# EAGLE design BM_ pre (EAGLE 8.1.0)

## Sheet 1 of 3: Microcontroller
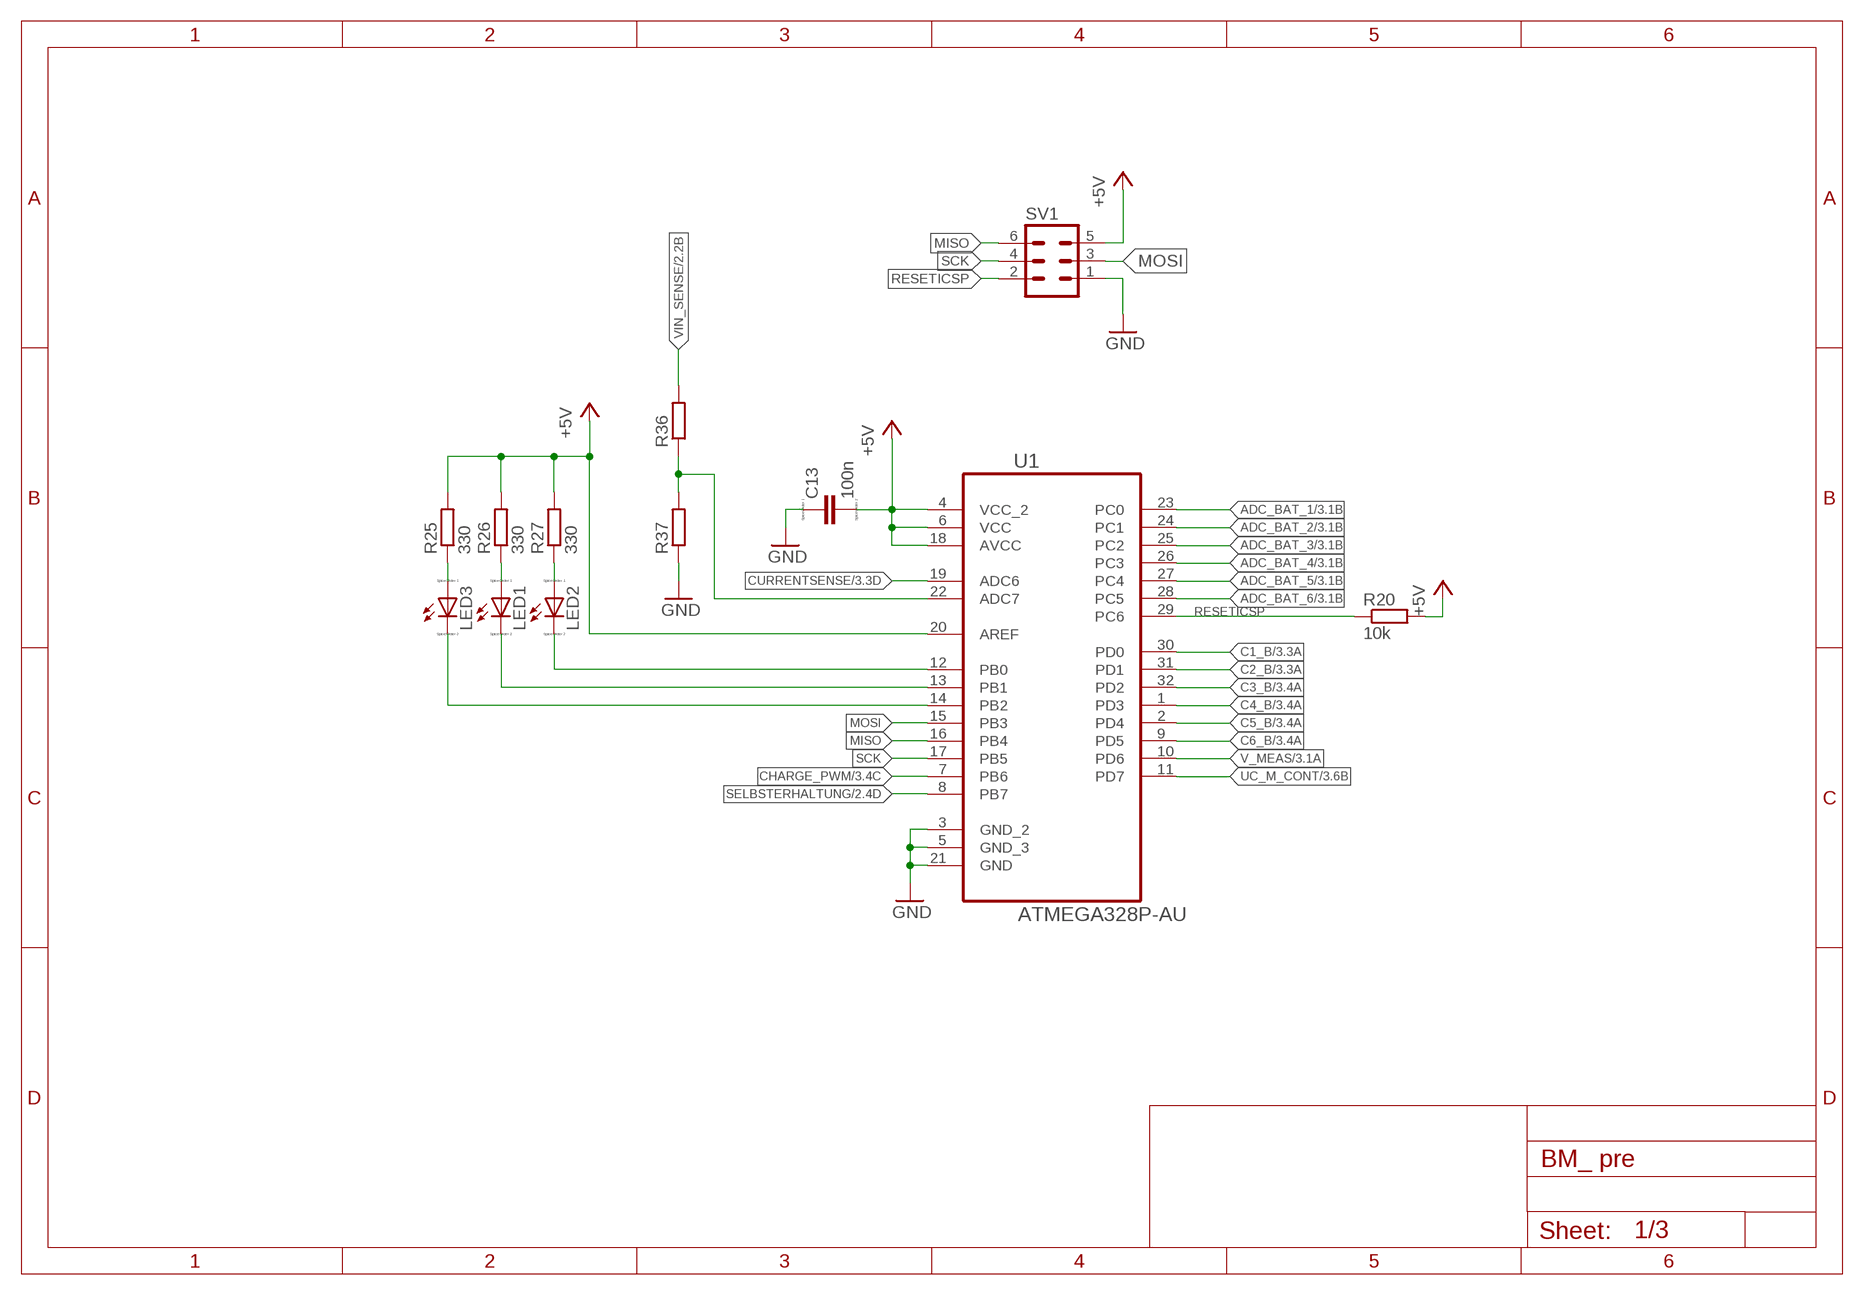
[diagram p0: schematic, sheet 1]

### Parts
C13  100n  CC0603  [C0603]
LED1  LED_E  [LED_1206]
LED2  LED_E  [LED_1206]
LED3  LED_E  [LED_1206]
R20  10k  R-EU_R0603  [R0603]
R25  330  R-EU_R0603  [R0603]
R26  330  R-EU_R0603  [R0603]
R27  330  R-EU_R0603  [R0603]
R36  R-EU_R0603  [R0603]
R37  R-EU_R0603  [R0603]
SV1  MA03-2  [MA03-2]
U1  ATMEGA328P-AU  [QFP80P900X900X120-32N]

### Nets
+5V: C13.2 R20.2 R25.2 R26.2 R27.2 SV1.5 U1.4(VCC_2) U1.6(VCC) U1.18(AVCC) U1.20(AREF) ; also sheet 2,3
ADC_BAT_1: U1.23(PC0) ; also sheet 3
ADC_BAT_2: U1.24(PC1) ; also sheet 3
ADC_BAT_3: U1.25(PC2) ; also sheet 3
ADC_BAT_4: U1.26(PC3) ; also sheet 3
ADC_BAT_5: U1.27(PC4) ; also sheet 3
ADC_BAT_6: U1.28(PC5) ; also sheet 3
C1_B: U1.30(PD0) ; also sheet 3
C2_B: U1.31(PD1) ; also sheet 3
C3_B: U1.32(PD2) ; also sheet 3
C4_B: U1.1(PD3) ; also sheet 3
C5_B: U1.2(PD4) ; also sheet 3
C6_B: U1.9(PD5) ; also sheet 3
CHARGE_PWM: U1.7(PB6) ; also sheet 3
CURRENTSENSE: U1.19(ADC6) ; also sheet 3
GND: C13.1 R37.1 SV1.1 U1.3(GND_2) U1.5(GND_3) U1.21(GND) ; also sheet 2,3
MISO: SV1.6 U1.16(PB4)
MOSI: SV1.3 U1.15(PB3)
N$17: LED2.C U1.12(PB0)
N$18: LED1.C U1.13(PB1)
N$19: LED3.C U1.14(PB2)
N$23: LED2.A R27.1
N$24: LED1.A R26.1
N$25: LED3.A R25.1
N$27: R36.1 R37.2 U1.22(ADC7)
RESETICSP: R20.1 SV1.2 U1.29(PC6)
SCK: SV1.4 U1.17(PB5)
SELBSTERHALTUNG: U1.8(PB7) ; also sheet 2
UC_M_CONT: U1.11(PD7) ; also sheet 3
V_MEAS: U1.10(PD6) ; also sheet 3
VIN_SENSE: R36.2 ; also sheet 2

## Sheet 2 of 3: Power Management
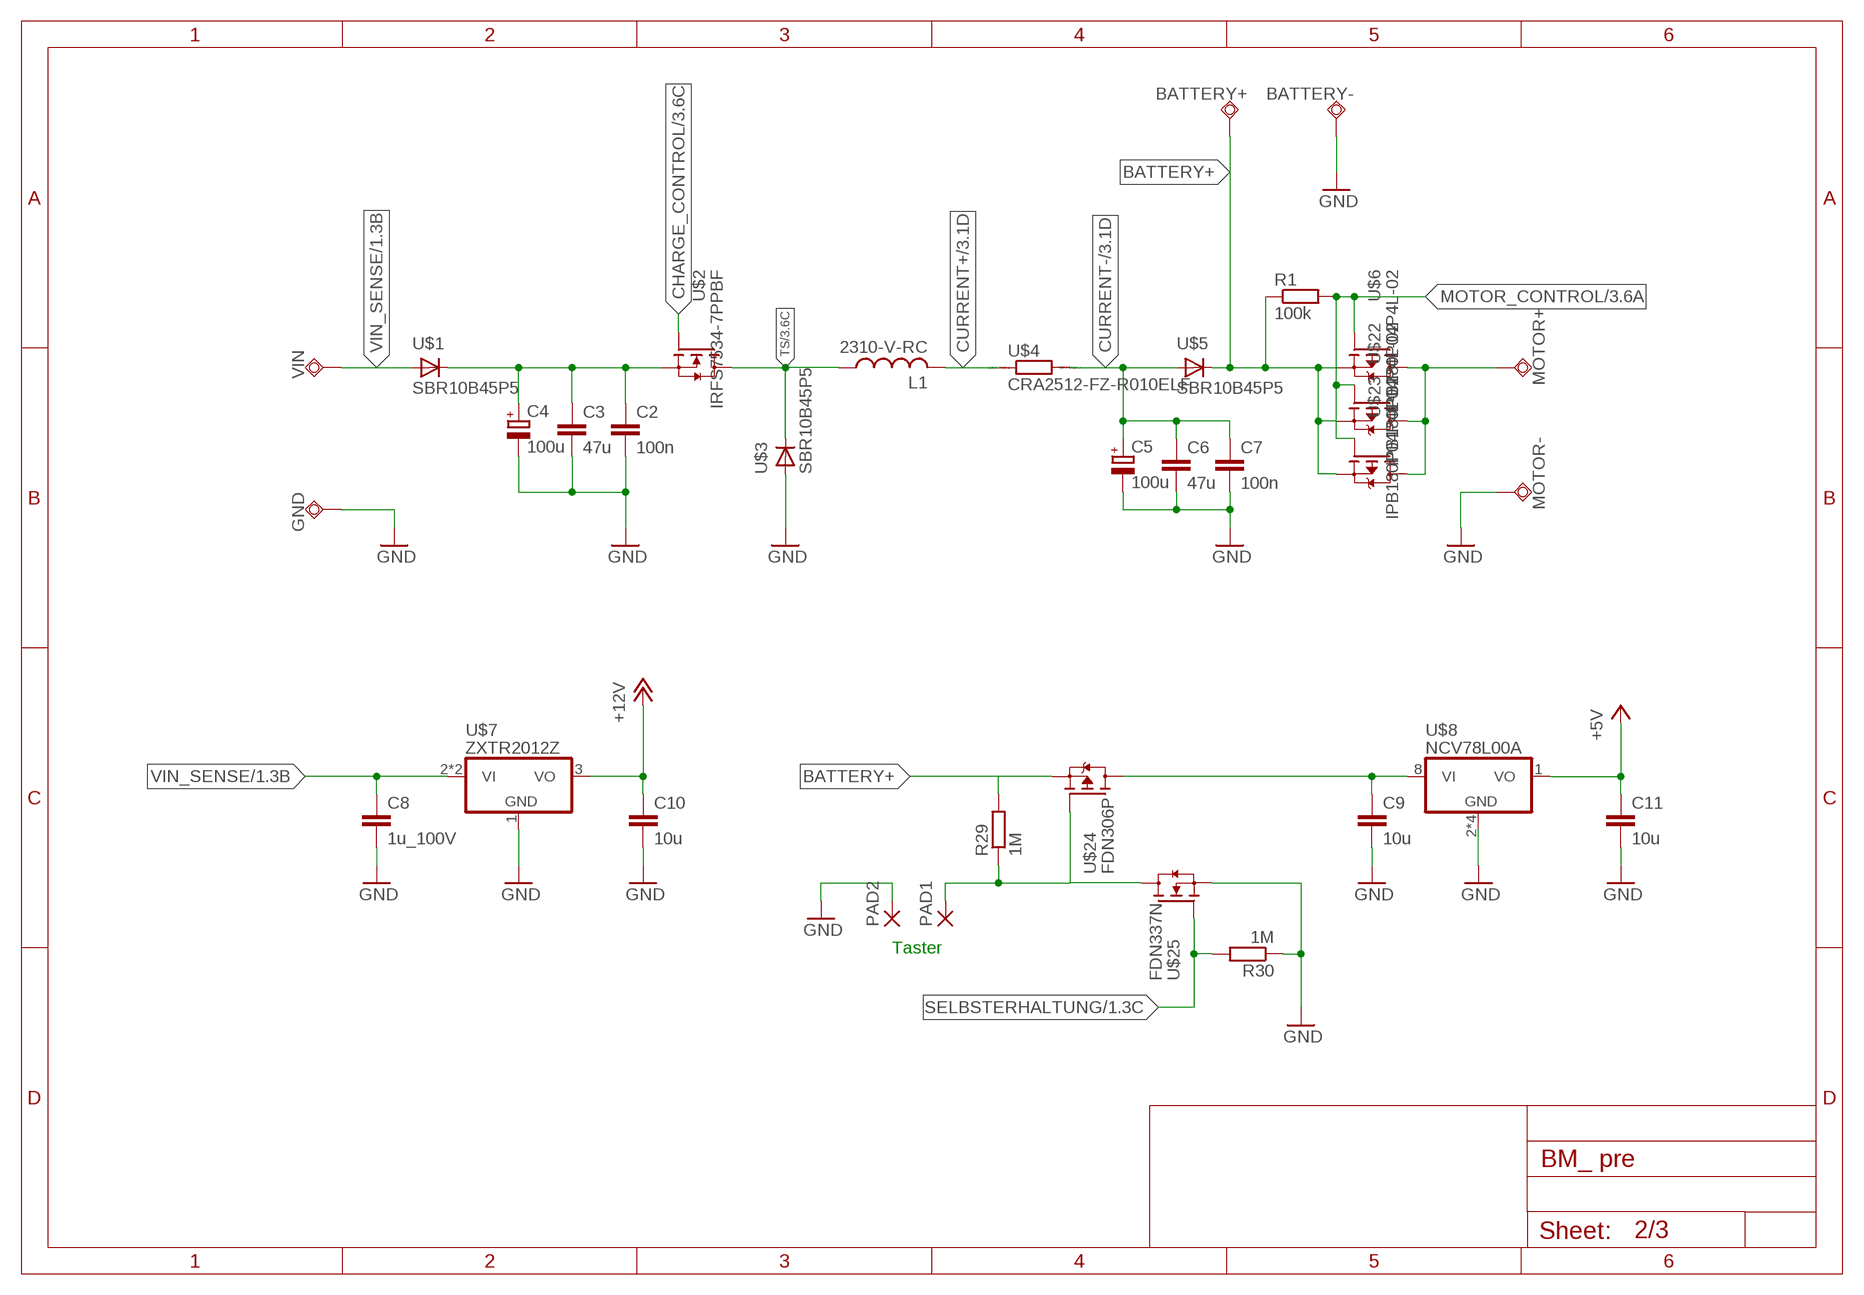
[diagram p1: schematic, sheet 2]

### Parts
BATTERY+  Battery+  PAD  [TESTPAD]
BATTERY-  Battery+  PAD  [TESTPAD]
C2  100n  C-EUC0603  [C0603]
C3  47u  C-EUC1812  [C1812]
C4  100u  CPOL-EUE3.5-10  [E3,5-10]
C5  100u  CPOL-EUE3.5-10  [E3,5-10]
C6  47u  C-EUC1812  [C1812]
C7  100n  C-EUC0603  [C0603]
C8  1u_100V  C-EUC1206  [C1206]
C9  10u  C-EUC0805  [C0805]
C10  10u  C-EUC0805  [C0805]
C11  10u  C-EUC0805  [C0805]
GND  Battery+  PAD  [TESTPAD]
L1  2310-V-RC  [IND_23XX-V_53_53]
MOTOR+  Battery+  PAD  [TESTPAD]
MOTOR-  PAD  [TESTPAD]
PAD1  SMD5  [SMD2,54-5,08]
PAD2  SMD5  [SMD2,54-5,08]
R1  100k  R-EU_R0603  [R0603]
R29  1M  R-EU_R0603  [R0603]
R30  1M  R-EU_R0603  [R0603]
U$1  SBR10B45P5  [POWERDI-5]
U$2  IRFS7534-7PPBF  [PG-TO263-7-3]
U$3  SBR10B45P5  [POWERDI-5]
U$4  CRA2512-FZ-R010ELF  [R2512]
U$5  SBR10B45P5  [POWERDI-5]
U$6  IPB180P04P4L-02  [PG-TO263-7-3]
U$7  ZXTR2012Z  [SOT89]
U$8  NCV78L00A  [SOIC8]
U$22  IPB180P04P4L-02  [PG-TO263-7-3]
U$23  IPB180P04P4L-02  [PG-TO263-7-3]
U$24  FDN306P  [SOT23]
U$25  FDN337N  [SOT23]
VIN  Battery+  PAD  [TESTPAD]

### Nets
+5V: C11.1 U$8.1(VO) ; also sheet 1,3
+12V: C10.1 U$7.3(VO) ; also sheet 3
BATTERY+: BATTERY+.P$1(TP) R1.1 R29.2 U$5.PAD(C) U$6.2(S) U$6.3(S) U$6.5(S) U$6.6(S) U$6.7(S) U$22.2(S) U$22.3(S) U$22.5(S) U$22.6(S) U$22.7(S) U$23.2(S) U$23.3(S) U$23.5(S) U$23.6(S) U$23.7(S) U$24.2(S)
CHARGE_CONTROL: U$2.1(G) ; also sheet 3
CURRENT+: L1.2 U$4.1 ; also sheet 3
CURRENT-: C5.+ C6.1 C7.1 U$4.2 U$5.L(A) U$5.R(A) ; also sheet 3
GND: BATTERY-.P$1(TP) C2.2 C3.2 C4.- C5.- C6.2 C7.2 C8.2 C9.2 C10.2 C11.2 GND.P$1(TP) MOTOR-.P$1(TP) PAD2.1(P) R30.1 U$3.L(A) U$3.R(A) U$7.1(GND) U$8.2(GND) U$8.3(GND) U$8.6(GND) U$8.7(GND) U$25.2(S) ; also sheet 1,3
MOTOR+: MOTOR+.P$1(TP) U$6.8(D) U$22.8(D) U$23.8(D)
MOTOR_CONTROL: R1.2 U$6.1(G) U$22.1(G) U$23.1(G) ; also sheet 3
N$1: C2.1 C3.1 C4.+ U$1.PAD(C) U$2.2(S) U$2.3(S) U$2.5(S) U$2.6(S) U$2.7(S)
N$20: PAD1.1(P) R29.1 U$24.1(G) U$25.3(D)
SELBSTERHALTUNG: R30.2 U$25.1(G) ; also sheet 1
TEST: C9.1 U$8.8(VI) U$24.3(D)
TS: L1.1 U$2.8(D) U$3.PAD(C) ; also sheet 3
VIN_SENSE: C8.1 U$1.L(A) U$1.R(A) U$7.2(VI) U$7.2@1(VI) VIN.P$1(TP) ; also sheet 1

### Notes on the sheet
- Taster

## Sheet 3 of 3: Battery Balancing and charging Addition
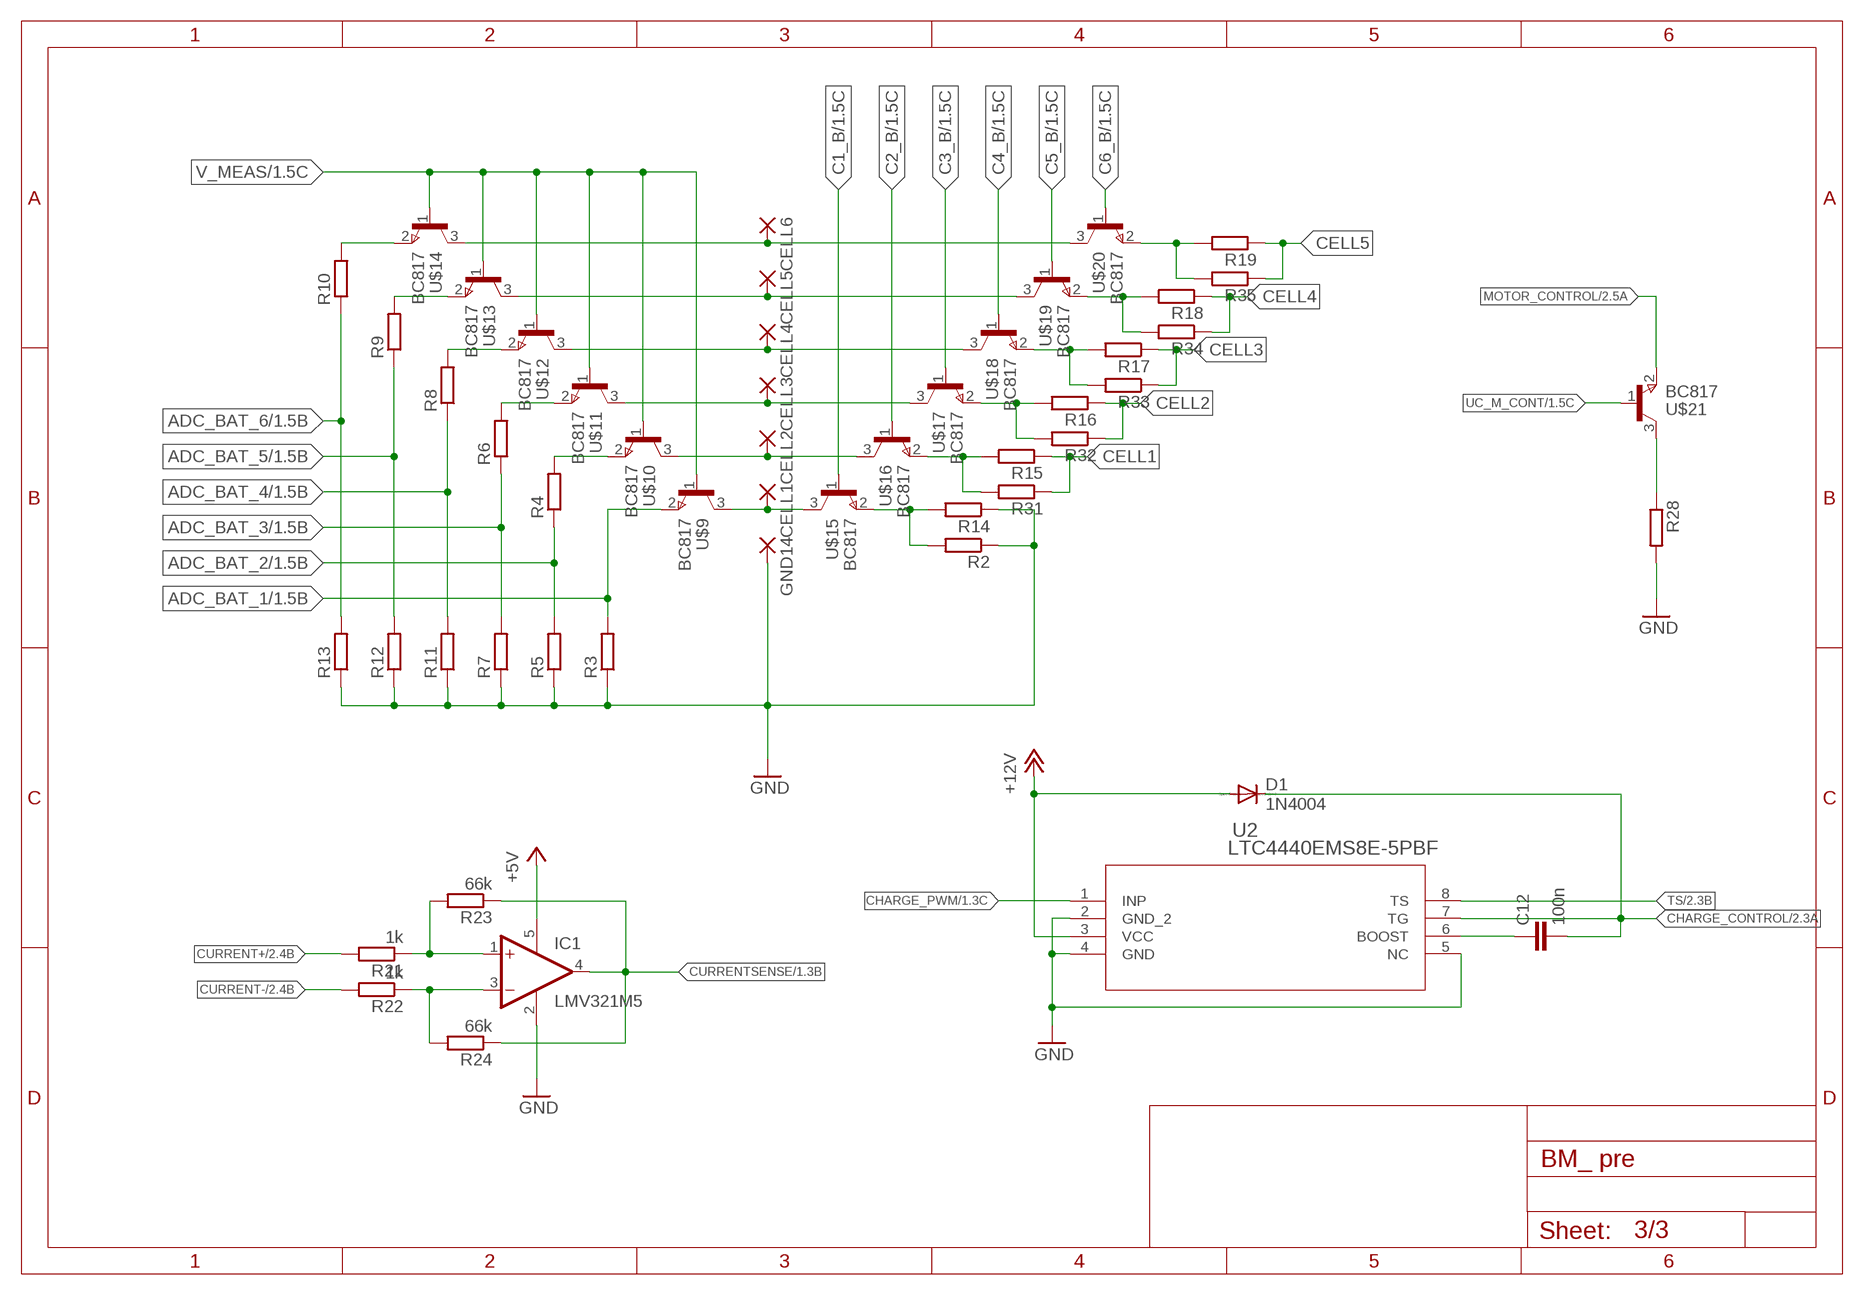
[diagram p2: schematic, sheet 3]

### Parts
C12  100n  C-EUC0603  [C0603]
CELL1  SMD5  [SMD2,54-5,08]
CELL2  SMD5  [SMD2,54-5,08]
CELL3  SMD5  [SMD2,54-5,08]
CELL4  SMD5  [SMD2,54-5,08]
CELL5  SMD5  [SMD2,54-5,08]
CELL6  SMD5  [SMD2,54-5,08]
D1  1N4004  [DO41-10]
GND14  SMD5  [SMD2,54-5,08]
IC1  LMV321M5  [SOT23-5]
R2  R-EU_R0603  [R0603]
R3  R-EU_R0603  [R0603]
R4  R-EU_R0603  [R0603]
R5  R-EU_R0603  [R0603]
R6  R-EU_R0603  [R0603]
R7  R-EU_R0603  [R0603]
R8  R-EU_R0603  [R0603]
R9  R-EU_R0603  [R0603]
R10  R-EU_R0603  [R0603]
R11  R-EU_R0603  [R0603]
R12  R-EU_R0603  [R0603]
R13  R-EU_R0603  [R0603]
R14  R-EU_R0603  [R0603]
R15  R-EU_R0603  [R0603]
R16  R-EU_R0603  [R0603]
R17  R-EU_R0603  [R0603]
R18  R-EU_R0603  [R0603]
R19  R-EU_R0603  [R0603]
R21  1k  R-EU_R0603  [R0603]
R22  1k  R-EU_R0603  [R0603]
R23  66k  R-EU_R0603  [R0603]
R24  66k  R-EU_R0603  [R0603]
R28  R-EU_R0603  [R0603]
R31  R-EU_R0603  [R0603]
R32  R-EU_R0603  [R0603]
R33  R-EU_R0603  [R0603]
R34  R-EU_R0603  [R0603]
R35  R-EU_R0603  [R0603]
U2  LTC4440EMS8E-5PBF  [MSOP-8_MS]
U$9  BC817  [SOT23]
U$10  BC817  [SOT23]
U$11  BC817  [SOT23]
U$12  BC817  [SOT23]
U$13  BC817  [SOT23]
U$14  BC817  [SOT23]
U$15  BC817  [SOT23]
U$16  BC817  [SOT23]
U$17  BC817  [SOT23]
U$18  BC817  [SOT23]
U$19  BC817  [SOT23]
U$20  BC817  [SOT23]
U$21  BC817  [SOT23]

### Nets
+5V: IC1.5(V+) ; also sheet 1,2
+12V: D1.A U2.3(VCC) ; also sheet 2
ADC_BAT_1: R3.2 U$9.2(E) ; also sheet 1
ADC_BAT_2: R4.1 R5.2 ; also sheet 1
ADC_BAT_3: R6.1 R7.2 ; also sheet 1
ADC_BAT_4: R8.1 R11.2 ; also sheet 1
ADC_BAT_5: R9.1 R12.2 ; also sheet 1
ADC_BAT_6: R10.1 R13.2 ; also sheet 1
C1_B: U$15.1(B) ; also sheet 1
C2_B: U$16.1(B) ; also sheet 1
C3_B: U$17.1(B) ; also sheet 1
C4_B: U$18.1(B) ; also sheet 1
C5_B: U$19.1(B) ; also sheet 1
C6_B: U$20.1(B) ; also sheet 1
CELL1: CELL1.1(P) R15.1 R31.1 U$9.3(C) U$15.3(C)
CELL2: CELL2.1(P) R16.1 R32.1 U$10.3(C) U$16.3(C)
CELL3: CELL3.1(P) R17.1 R33.1 U$11.3(C) U$17.3(C)
CELL4: CELL4.1(P) R18.1 R34.1 U$12.3(C) U$18.3(C)
CELL5: CELL5.1(P) R19.1 R35.1 U$13.3(C) U$19.3(C)
CELL6: CELL6.1(P) U$14.3(C) U$20.3(C)
CHARGE_CONTROL: C12.2 D1.C U2.7(TG) ; also sheet 2
CHARGE_PWM: U2.1(INP) ; also sheet 1
CURRENT+: R21.2 ; also sheet 2
CURRENT-: R22.2 ; also sheet 2
CURRENTSENSE: IC1.4(OUT) R23.1 R24.1 ; also sheet 1
GND: GND14.1(P) IC1.2(V-) R2.1 R3.1 R5.1 R7.1 R11.1 R12.1 R13.1 R14.1 R28.2 U2.2(GND_2) U2.4(GND) U2.5(NC) ; also sheet 1,2
MOTOR_CONTROL: U$21.2(E) ; also sheet 2
N$2: C12.1 U2.6(BOOST)
N$4: R4.2 U$10.2(E)
N$5: R2.2 R14.2 U$15.2(E)
N$6: R15.2 R31.2 U$16.2(E)
N$7: R6.2 U$11.2(E)
N$8: R8.2 U$12.2(E)
N$9: R9.2 U$13.2(E)
N$10: R10.2 U$14.2(E)
N$11: R16.2 R32.2 U$17.2(E)
N$12: R17.2 R33.2 U$18.2(E)
N$13: R18.2 R34.2 U$19.2(E)
N$14: R19.2 R35.2 U$20.2(E)
N$15: IC1.1(+IN) R21.1 R23.2
N$16: IC1.3(-IN) R22.1 R24.2
N$26: R28.1 U$21.3(C)
TS: U2.8(TS) ; also sheet 2
UC_M_CONT: U$21.1(B) ; also sheet 1
V_MEAS: U$9.1(B) U$10.1(B) U$11.1(B) U$12.1(B) U$13.1(B) U$14.1(B) ; also sheet 1

## Library data of the parts
BATTERY+ BATTERY- GND MOTOR+ MOTOR- VIN = BM_pre:PAD
C2 C3 C6-C12 = rcl:C-EU: CAPACITOR, European symbol
C4 C5 = rcl:CPOL-EU: POLARIZED CAPACITOR, European symbol
C13 = eagle-ltspice:C: CAPACITOR, European symbol; SPICEMODEL: NONE; SPICEPREFIX: C
CELL1-CELL6 GND14 PAD1 PAD2 = wirepad:SMD5: SMD PAD
D1 = diode:1N4004: DIODE general purpose rectifier, 1 A
IC1 = BM_pre:LMV321?*: General Purpose, Low Voltage, Rail-to-Rail Output Operational Amplifiers Source: http://www.national.com/mpf/LM/LMV321.html http://www.national.com/dt/lmv_qual.pdf
L1 = BM_pre:2310-V-RC; MANUFACTURER_PART_NUMBER: 2310VRC; VENDOR: Bourns Electronics
LED1-LED3 = eagle-ltspice:LED_E: LED Source: http://www.osram.convergy.de Source: www.luxeon.com Source: www.kingbright.com; SPICEMODEL: NONE; SPICEPREFIX: D; SPICETYPE: diode
R1-R37 = rcl:R-EU_: RESISTOR, European symbol
SV1 = con-lstb:MA03-2: PIN HEADER; OC_FARNELL: unknown; OC_NEWARK: unknown
U1 = Atmel_By_element14_Batch_1-00:ATMEGA328P-AU: 8-bit Microcontroller with In-System Programmable Flash; MPN: ATMEGA328P-AU; OC_FARNELL: 1715486; OC_NEWARK: 14R4631; PACKAGE: TQFP-32; SUPPLIER: Atmel
U2 = BM_pre:LTC4440EMS8E-5PBF; MANUFACTURER_PART_NUMBER: ltc4440ems8e5#pbf; VENDOR: Linear Technology
U$1 U$3 U$5 = BM_pre:SBR10B45P5
U$2 = BM_pre:IRFS7534-7PPBF
U$4 = BM_pre:CRA2512-FZ-R010ELF
U$6 U$22 U$23 = BM_pre:IPB180P04P4L-02
U$7 = BM_pre:ZXTR2012Z
U$8 = BM_pre:NCV78L00A
U$9-U$21 = BM_pre:BC817
U$24 = BM_pre:FDN306P
U$25 = BM_pre:FDN337N

## Board
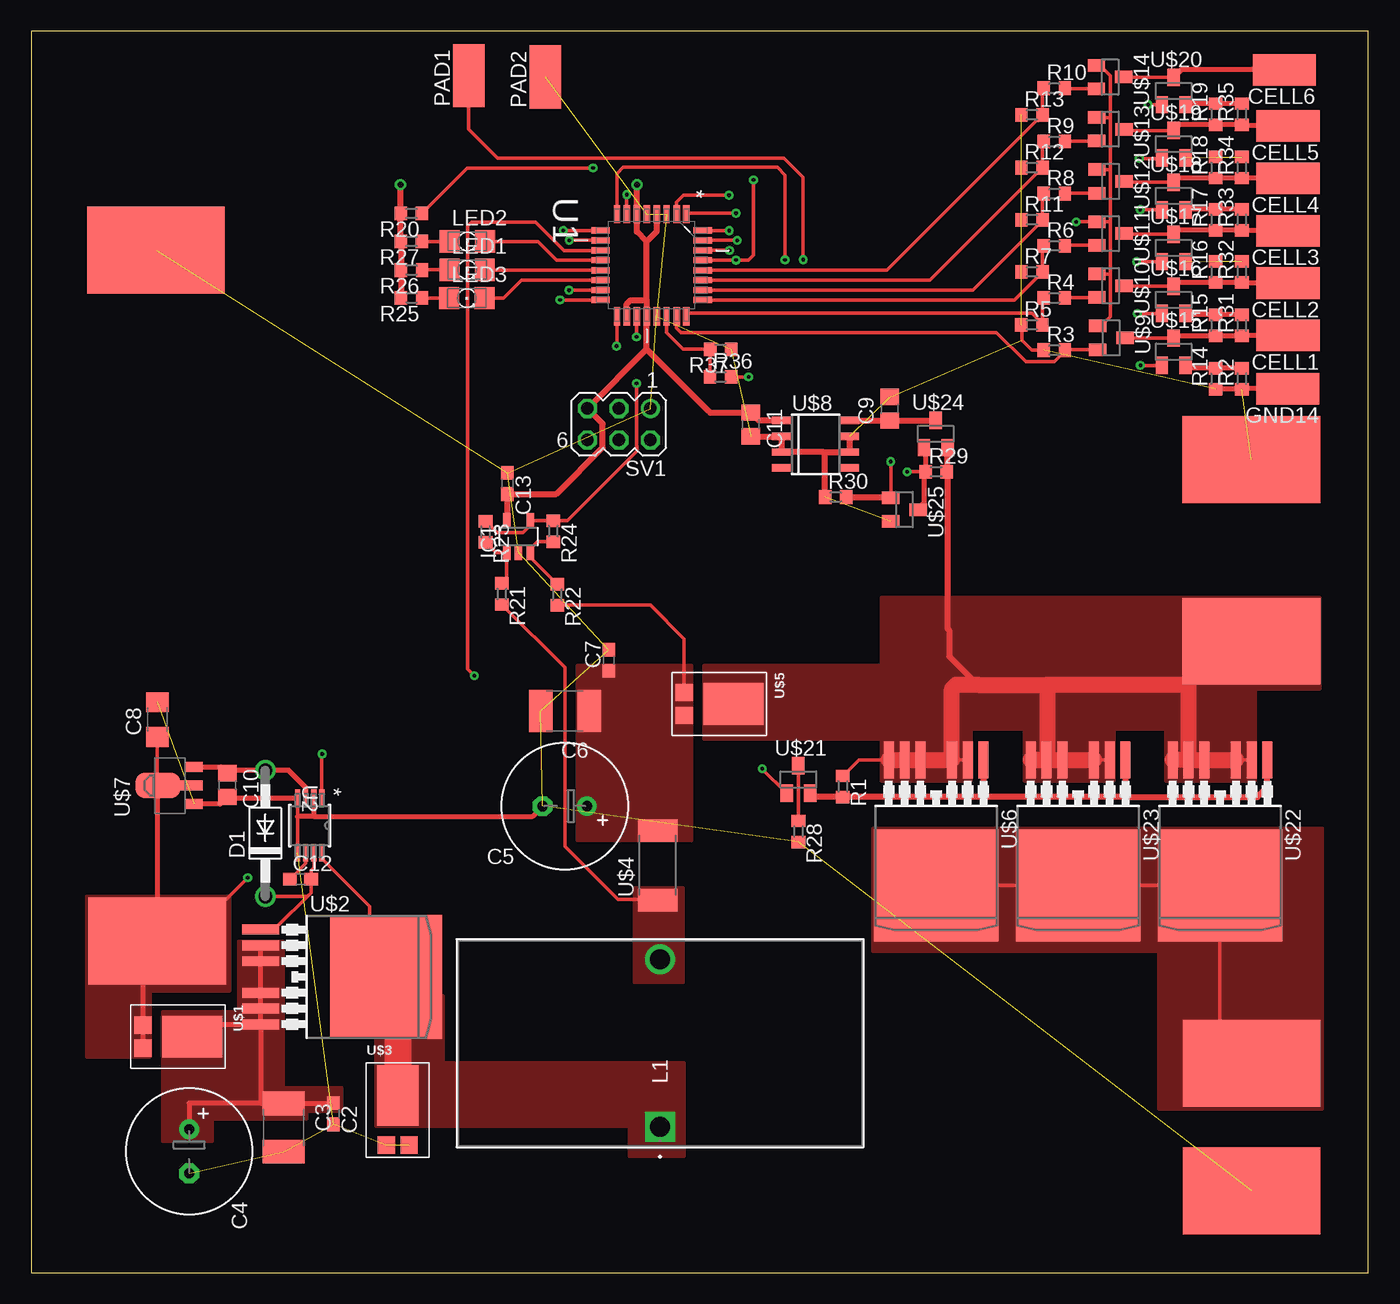
[diagram p3: board, top side]
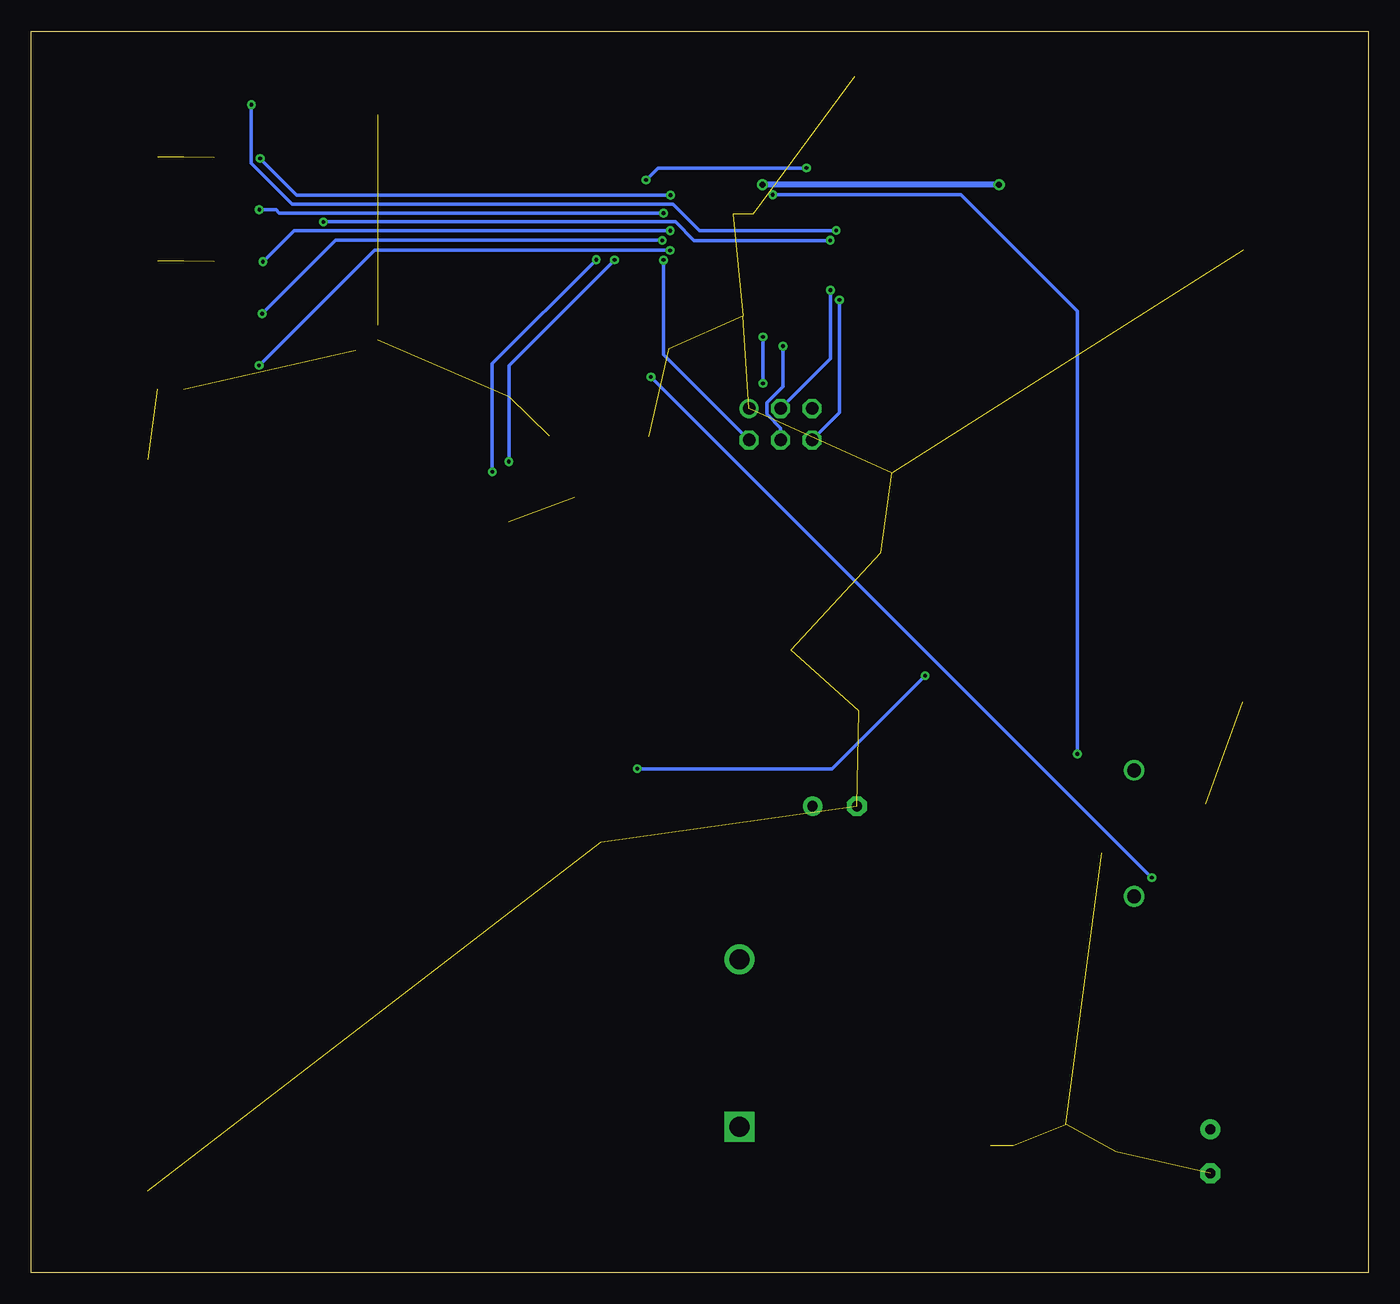
[diagram p4: board, bottom side, seen from below]

Size 107.7 x 100 mm. Coordinates in mm from the lower left corner, seen from the top.
Outline: 0,0 107.7,0 107.7,100 0,100 0,0
Copper layers (1*16): Top 0.035mm / dielectric 1.5mm / Bottom 0.035mm
Design rules "default *": minimum track width 0.3mm, minimum drill 0.00761875mm, track to track 8mil, track to pad 8mil, pad to pad 8mil, via to via 8mil, smd to smd 8mil, copper to edge 40mil, drill to drill 8mil, minimum pad ring 10mil, minimum via ring 8mil, stop-mask expansion 4mil, vias tented up to drill 0mil, thermal gap 10mil

### Footprints (pad centres in the part's own frame; a part is rotated, then mirrored left to right if it is on the bottom)
TESTPAD = smd 11.1 x 7: P$1 0,0
C0603 = smd 1.1 x 1: 1 -0.85,0; 2 0.85,0
C1812 = smd 1.9 x 3.4: 1 -1.95,0; 2 1.95,0
E3,5-10 = drill 0.813 pad 1.6: + -1.778,0 | drill 0.813 pad 1.6 octagon: - 1.778,0
C1206 = smd 1.6 x 1.8: 1 -1.4,0; 2 1.4,0
C0805 = smd 1.3 x 1.5: 1 -0.95,0; 2 0.95,0
SMD2,54-5,08 = smd 2.54 x 5.08: 1 0,0
DO41-10 = drill 1.118: A 5.08,0; C -5.08,0
SOT23-5 = smd 0.6 x 1.2: 1 -0.95,-1.306; 2 0,-1.306; 3 0.95,-1.306; 4 0.95,1.306; 5 -0.95,1.306
IND_23XX-V_53_53 = drill 1.6 pad 2.108 square: 1 -13.462,0 | drill 1.6 pad 2.108: 2 0,0
LED_1206 = smd 1.6 x 1.803: A -1.422,0; C 1.422,0
R0603 = smd 1 x 1.1: 1 -0.85,0; 2 0.85,0
MA03-2 = drill 1.016: 1 -2.54,-1.27 | drill 1.016 octagon: 2 -2.54,1.27; 3 0,-1.27; 4 0,1.27; 5 2.54,-1.27; 6 2.54,1.27
QFP80P900X900X120-32N = smd 1.473 x 0.508: 1 -4.115,2.794; 2 -4.115,2.007; 3 -4.115,1.194; 4 -4.115,0.406; 5 -4.115,-0.406; 6 -4.115,-1.194; 7 -4.115,-2.007; 8 -4.115,-2.794; 17 4.115,-2.794; 18 4.115,-2.007; 19 4.115,-1.194; 20 4.115,-0.406; 21 4.115,0.406; 22 4.115,1.194; 23 4.115,2.007; 24 4.115,2.794 | smd 0.508 x 1.473: 9 -2.794,-4.115; 10 -2.007,-4.115; 11 -1.194,-4.115; 12 -0.406,-4.115; 13 0.406,-4.115; 14 1.194,-4.115; 15 2.007,-4.115; 16 2.794,-4.115; 25 2.794,4.115; 26 2.007,4.115; 27 1.194,4.115; 28 0.406,4.115; 29 -0.406,4.115; 30 -1.194,4.115; 31 -2.007,4.115; 32 -2.794,4.115
MSOP-8_MS = smd 1.397 x 0.432: 1 -2.21,0.975; 2 -2.21,0.325; 3 -2.21,-0.325; 4 -2.21,-0.975; 5 2.21,-0.975; 6 2.21,-0.325; 7 2.21,0.325; 8 2.21,0.975
POWERDI-5 = smd 1.39 x 1.4: L -0.92,-1.552; R 0.92,-1.552 | smd 3.36 x 4.86: PAD 0,2.43
PG-TO263-7-3 = smd 0.8 x 3: 1 -3.81,-9.207; 2 -2.54,-9.207; 3 -1.27,-9.207; 5 1.27,-9.207; 6 2.54,-9.207; 7 3.81,-9.207 | smd 10 x 9: 8 0,0.895
R2512 = smd 1.8 x 3.2: 1 -2.8,0; 2 2.8,0
SOT89 = smd 0.8 x 1.4: 1 -1.499,-1.981; 3 1.499,-1.981 | smd 0.8 x 1.9: 2 0,-1.727 | smd 2.032 x 3.65: 2@1 0,0.94
SOIC8 = smd 0.6 x 1.5: 1 -1.905,-2.75; 2 -0.635,-2.75; 3 0.635,-2.75; 4 1.905,-2.75; 5 1.905,2.75; 6 0.635,2.75; 7 -0.635,2.75; 8 -1.905,2.75
SOT23 = smd 1 x 1.4: 1 -0.95,-1.1; 2 0.95,-1.1; 3 0,1.1

### Placement (x,y rotation side)
BATTERY+  98.26,50.86 180 top
BATTERY-  98.26,65.49 180 top
C2  24.36,12.81 270 top
C3  20.34,11.7 270 top
C4  12.73,9.78 270 top
C5  42.98,37.58 180 top
C6  42.99,45.25 180 top
C7  46.52,49.33 90 top
C8  10.16,44.55 90 top
C9  69.15,69.59 90 top
C10  15.8,39.28 270 top
C11  57.97,68.31 270 top
C12  21.7,31.7 0 top
C13  38.37,63.56 270 top
CELL1  101.22,75.48 90 top
CELL2  101.22,79.7 90 top
CELL3  101.22,83.92 90 top
CELL4  101.22,88.14 90 top
CELL5  101.22,92.36 90 top
CELL6  100.92,96.88 90 top
D1  18.87,35.39 90 top
GND  10.06,82.37 0 top
GND14  101.2,71.2 90 top
IC1  39.26,59.29 0 top
L1  50.65,25.23 90 top
LED1  35.12,80.78 0 top
LED2  35.13,83.05 0 top
LED3  35.1,78.49 0 top
MOTOR+  98.29,16.86 0 top
MOTOR-  98.29,6.62 0 top
PAD1  35.25,96.42 0 top
PAD2  41.4,96.31 0 top
R1  65.37,39.16 270 top
R2  97.5,72 90 top
R3  82.4,74.3 0 top
R4  82.4,78.5 0 top
R5  80.59,76.33 0 top
R6  82.4,82.7 0 top
R7  80.6,80.6 0 top
R8  82.4,86.9 0 top
R9  82.4,91.1 0 top
R10  82.4,95.4 0 top
R11  80.6,84.8 0 top
R12  80.6,89 0 top
R13  80.6,93.25 0 top
R14  95.4,72 90 top
R15  95.4,76.3 90 top
R16  95.4,80.6 90 top
R17  95.4,84.8 90 top
R18  95.4,89 90 top
R19  95.4,93.3 90 top
R20  30.62,85.31 180 top
R21  37.91,54.66 270 top
R22  42.38,54.61 270 top
R23  36.6,59.68 270 top
R24  42.06,59.73 270 top
R25  30.64,78.5 180 top
R26  30.64,80.75 180 top
R27  30.62,83.06 180 top
R28  61.8,35.54 270 top
R29  72.89,64.5 0 top
R30  64.8,62.47 0 top
R31  97.5,76.3 90 top
R32  97.5,80.6 90 top
R33  97.5,84.8 90 top
R34  97.5,89 90 top
R35  97.5,93.3 90 top
R36  55.52,72.14 0 top
R37  55.53,74.37 180 top
SV1  47.34,68.34 180 top
U1  49.98,81.14 270 top
U2  22.44,36.02 270 top
U$1  10.55,19.02 270 top
U$2  27.7,23.83 270 top
U$3  29.53,11.83 0 top
U$4  50.46,32.81 90 top
U$5  54.14,45.81 270 top
U$6  72.89,32.1 180 top
U$7  11.16,39.24 90 top
U$8  63.18,66.73 270 top
U$9  86.99,75.29 270 top
U$10  86.93,79.49 270 top
U$11  86.93,83.69 270 top
U$12  86.93,87.89 270 top
U$13  86.91,92.09 270 top
U$14  86.89,96.29 270 top
U$15  92.01,74.17 0 top
U$16  92.01,78.35 0 top
U$17  92.01,82.53 0 top
U$18  92.01,86.71 0 top
U$19  92.01,90.89 0 top
U$20  92.01,95.17 0 top
U$21  61.79,39.73 0 top
U$22  95.75,32.1 180 top
U$23  84.32,32.1 180 top
U$24  72.85,67.56 0 top
U$25  70.33,61.46 270 top
VIN  10.16,26.72 0 top

### Tracks (layer width: path | path; a pad name or v marks a point on that pad's centre or on a via)
+5V  (via drill 0.5)
  Top 0.3: U1.6 | 49.55,78.31 49.57,78.33 | 54.43,69.51 54.44,69.51 | 38.3,60.31 IC1.5 38.37,60.66
  Top 0.5: 49.57,74.38 SV1.5 46.03,68.38 46.03,66.44 42.3,62.72 C13.2 38.37,60.66 | 49.57,74.38 U1.20 49.57,78.33 49.57,83.05 | 49.57,83.05 48.79,83.83 U1.6 | U1.4 50.39,83.86 49.57,83.05 | U1.18 47.97,78.02 48.26,78.31 49.55,78.31 | U$8.1 58.59,68.64 C11.1 54.7,69.26 54.44,69.51 49.57,74.38 | R25.2 R26.2 29.79,83.04 R27.2 R20.2 29.77,87.38 29.78,87.39 29.78,87.6 v29.75,87.63 | U1.6 v48.79,87.63
  Bottom 0.5: v29.75,87.63 v48.79,87.63 | v48.79,87.63 48.82,87.63 48.83,87.62 v48.8,87.62 v48.79,87.63
+12V
  Top 0.4: U2.3 22.11,39.1 20.76,40.46 D1.A 16.04,40.47 C10.1 15.29,40.74 U$7.3
ADC_BAT_1
  Top 0.3: U$9.2 83.25,74.34 R3.2 83.25,74.22 82.41,73.38 80.1,73.38 77.75,75.73 52.34,75.73 51.98,76.09 U1.23
ADC_BAT_2
  Top 0.3: R4.1 81.45,78.5 R5.2 81.44,76.41 80.58,77.27 53.02,77.27 U1.24
ADC_BAT_3
  Top 0.3: R6.1 81.45,82.7 R7.2 79.2,78.35 U1.25
ADC_BAT_4
  Top 0.3: R8.1 81.45,86.9 R11.2 81.45,84.73 75.85,79.13 U1.26
ADC_BAT_5
  Top 0.3: R9.1 81.45,91.1 R12.2 72.4,79.95 U1.27
ADC_BAT_6
  Top 0.3: R10.1 81.45,95.4 R13.2 | R13.2 81.45,93.12 81.12,92.79 | R13.2 68.93,80.73 U1.28
BATTERY+
  Top 0.3: U$23.3 U$23.2 | U$22.3 U$22.2 | U$6.3 U$6.2 | BATTERY+.P$1 96.92,50.86 93.21,47.15 | R1.1 66.67,41.31 U$6.7
  Top 0.4: U$24.2 73.75,66.41 | R29.2 73.8,64.45
  Top 0.5: 76.26,47.34 73.95,49.65 73.95,51.73 73.8,51.88 73.8,64.45 | 73.75,66.41 R29.2
  Top 1.27: 81.84,47.33 81.83,47.34 76.26,47.34 74.48,47.34 74.16,47.02 U$6.3 U$6.5 U$6.6 U$6.7 | 81.84,47.33 81.84,41.37 U$23.6 | U$23.6 U$23.7 U$23.5 | U$23.6 U$23.5 | U$22.6 93.21,47.15 93.04,47.32 81.85,47.32 81.84,47.33 | U$22.6 U$22.7 | U$22.6 U$22.5 U$22.3 | U$23.5 U$23.3
  pour Top (no thermals): 68.5,54.4 103.8,54.4 103.8,47 98.6,47 98.6,39.6 91.4,39.6 91.4,43.8 87.2,43.8 87.2,39.6 80,39.6 80,43.8 75.7,43.8 75.7,39.6 68.5,39.6
  pour Top (no thermals): 54.2,48.9 54.2,43 69,43 69,48.9
C1_B  (via drill 0.3)
  Top 0.3: v56.24,82.34 U1.30 | U$15.1 v89.34,73.07
  Bottom 0.3: v89.34,73.07 80.04,82.37 56.27,82.37 v56.24,82.34
C2_B  (via drill 0.3)
  Top 0.3: U1.31 56.03,83.15 56.03,83.14 v56.87,83.14 | v89.08,77.25 U$16.1
  Bottom 0.3: v56.87,83.14 83.17,83.14 v89.07,77.25 v89.08,77.25
C3_B  (via drill 0.3)
  Top 0.3: U1.32 54.99,83.93 v56.22,83.93 v56.23,83.92 | v89.02,81.43 U$17.1
  Bottom 0.3: v56.23,83.92 86.53,83.92 v89.02,81.43
C4_B  (via drill 0.3)
  Top 0.3: U$18.1 v89.32,85.61 | v56.77,85.34 52.84,85.32 U1.1
  Bottom 0.3: v56.77,85.34 87.72,85.35 87.97,85.61 v89.32,85.61
C5_B  (via drill 0.3)
  Top 0.3: U$19.1 91.04,89.77 91.01,89.74 v89.25,89.74 | v56.2,86.79 52.55,86.79 51.99,86.23 U1.2
  Bottom 0.3: v56.2,86.79 86.3,86.79 v89.25,89.74
C6_B  (via drill 0.3)
  Top 0.3: v42.86,83.94 v42.87,83.93 U1.9 | U$20.1 v89.96,94.07
  Bottom 0.3: v89.96,94.07 89.96,89.36 86.67,86.07 56.02,86.07 53.89,83.94 43.08,83.94 v42.86,83.94
CELL1
  Top 0.3: U$15.3 88.11,75.27 U$9.3
  Top 0.4: CELL1.1 97.53,75.48 R31.1 R15.1 92.19,75.45 U$15.3
CELL2
  Top 0.3: U$16.3 87.85,79.45 87.5,79.1 87.68,79.1 U$10.3
  Top 0.4: CELL2.1 97.55,79.7 R32.1 R16.1 92.31,79.75 U$16.3
CELL3
  Top 0.3: U$17.3 88.11,83.63 U$11.3
  Top 0.4: U$17.3 92.33,83.95 R17.1 R33.1 97.53,83.92 CELL3.1
CELL4
  Top 0.3: U$18.3 88.11,87.81 U$12.3
  Top 0.4: CELL4.1 R34.1 R18.1 92.35,88.15 U$18.3
CELL5
  Top 0.3: U$19.3 88.11,91.99 U$13.3
  Top 0.4: CELL5.1 97.59,92.36 R35.1 R19.1 92.47,92.45 U$19.3
CELL6
  Top 0.3: U$20.3 88.01,96.27 U$14.3
  Top 0.4: CELL6.1 92.62,96.88 U$20.3
CHARGE_CONTROL
  Top 0.3: U2.7 22.78,32.63 22.55,32.4 C12.2 22.55,30.61 | 22.55,30.61 19.66,27.72 18.57,27.72 U$2.1 | D1.C 22.25,30.31 22.55,30.61
CHARGE_PWM  (via drill 0.3)
  Top 0.3: U1.7 47.97,86.1 v47.97,86.82 | v23.44,41.77 23.41,41.75 U2.1
  Bottom 0.3: v47.97,86.82 32.81,86.82 23.44,77.45 v23.44,41.77
CURRENT+
  Top 0.3: R21.2 42.98,48.73 42.98,34.34 47.27,30.07 50.41,30.07 U$4.1
  pour Top (no thermals): 48.6,31 52.5,31 52.5,23.4 48.6,23.4
CURRENT-
  Top 0.3: R22.2 49.88,53.76 52.6,51.03 52.6,46.74 U$5.L
  pour Top (no thermals): 44,48.9 44,34.8 53.2,34.8 53.2,48.9
CURRENTSENSE  (via drill 0.3)
  Top 0.3: 48.77,70.07 | 48.77,70.07 48.77,66.61 48.78,66.59 48.78,66.16 43.2,60.58 R24.1 42.04,60.6 IC1.4 40.12,60.51 40.12,60.09 39.62,59.6 37.53,59.6 R23.1 | v48.76,71.62 v48.77,71.62 48.77,70.07 | v48.76,75.38 48.76,76.99 U1.19
  Bottom 0.3: v48.76,75.38 v48.76,75.37 v48.76,71.62
GND  (29 unrouted)
  Top 0.3: R3.1 80.6,74.3 79.8,75.1 79.8,76.35 R5.1 | U2.4 21.46,36.73 U2.5
  Top 0.4: GND14.1 97.55,71.2 R2.1 R14.1 | 21.46,36.73 21.5,36.77 22.77,36.77 | C5.- 40.39,36.77 22.77,36.77 | U2.2 22.77,36.77 | U$7.1 15.21,37.75 C10.2 15.9,38.23 U2.4
  Top 0.5: C11.2 U$8.2 U$8.3 63.79,66.09 | 63.79,66.09 U$8.6 U$8.7 | R30.1 63.95,65.94 63.79,66.09
MISO  (via drill 0.3)
  Top 0.3: U1.16 44.95,78.35 44.95,78.34 v42.6,78.34 v42.6,78.35
  Bottom 0.3: v42.6,78.35 42.6,69.27 SV1.6
MOSI  (via drill 0.3)
  Top 0.3: v43.32,79.13 U1.15
  Bottom 0.3: SV1.3 43.32,73.63 v43.32,79.13
MOTOR+
  Top 0.3: U$6.8 U$23.8 U$22.8 95.75,19.4 MOTOR+.P$1
  pour Top (no thermals): 67.8,35.8 104,35.8 104,13.2 90.8,13.2 90.8,25.9 67.8,25.9
MOTOR_CONTROL
  Top 0.3: 88.13,40.21 U$23.1
  Top 0.5: U$22.1 99.56,39.12 98.75,38.31 87.99,38.31 | 87.99,38.31 76.7,38.31 | U$23.1 88.13,38.45 87.99,38.31 | U$6.1 76.7,38.31 | 76.7,38.31 R1.2 63.05,38.31 U$21.2
N$1
  Top 0.4: U$1.PAD 13.98,20.02 U$2.7 | U$2.7 U$2.6 U$2.5 U$2.3 U$2.2 | U$2.7 18.49,13.65 C3.1 | C3.1 C2.1 | C3.1 12.73,13.65 C4.+
  pour Top (no thermals): 16.7,26.7 20.3,26.7 20.3,14.9 25,14.9 25,13 22.2,13 22.2,12.4 14.6,12.4 14.6,10.6 10.6,10.6 10.6,21 16.7,21
N$2
  Top 0.3: U2.6 22.11,32.97 C12.1
N$4
  Top 0.3: U$10.2 83.25,78.54 R4.2
N$5
  Top 0.4: R2.2 R14.2 93.18,72.85 U$15.2
N$6
  Top 0.4: R31.2 R15.2 93.06,77.15 U$16.2
N$7
  Top 0.3: U$11.2 83.25,82.74 R6.2
N$8
  Top 0.3: U$12.2 83.25,86.94 R8.2
N$9
  Top 0.3: U$13.2 83.25,91.14 R9.2
N$10
  Top 0.3: U$14.2 83.25,95.34 R10.2
N$11  (2 unrouted)
N$12
  Top 0.4: R33.2 R17.2 93,85.65 U$18.2
N$13  (2 unrouted)
N$14
  Top 0.4: R35.2 R19.2 93.04,94.15 U$20.2
N$15
  Top 0.3: R23.2 37.45,57.98 IC1.1 38.3,55.91 R21.1
N$16
  Top 0.3: R24.2 40.8,58.88 40.2,58.27 IC1.3 40.2,57.63 R22.1
N$17
  Top 0.3: LED2.C 40.82,83.05 42.33,81.54 U1.12
N$18
  Top 0.3: 45.82,80.78 U1.13 36.59,80.73 LED1.C
N$19
  Top 0.3: LED3.C 38.06,78.49 39.52,79.95 U1.14
N$20  (via drill 0.3)
  Top 0.3: PAD1.1 35.25,92.08 37.59,89.75 60.65,89.75 62.17,88.22 v62.17,81.59 | v70.56,64.5 R29.1
  Top 0.4: U$24.1 72.05,66.31 R29.1 71.9,64.36 71.9,61.93
  Top 0.5: 71.9,61.93 U$25.3
  Bottom 0.3: v62.17,81.59 70.56,73.22 v70.56,64.5
N$23
  Top 0.3: R27.1 LED2.A
N$24
  Top 0.3: R26.1 31.52,80.78 LED1.A
N$25
  Top 0.3: R25.1 LED3.A
N$26
  Top 0.3: U$21.3 61.79,36.41 R28.1
N$27
  Top 0.3: U1.22 51.17,75.71 52.51,74.38 R37.2 R36.1
RESETICSP  (via drill 0.3)
  Top 0.3: U1.29 56.76,81.55 v56.77,81.56 57.77,81.56 58.17,81.95 v58.17,88 | R20.1 35.13,88.97 v45.25,88.97
  Bottom 0.3: v56.77,81.56 56.77,73.96 SV1.2 | v45.25,88.97 57.2,88.97 58.15,88.03 v58.17,88
SCK  (via drill 0.3)
  Top 0.3: v47.15,74.63 47.19,74.67 U1.17
  Bottom 0.3: SV1.4 47.34,68.03 48.45,69.15 48.45,70.07 47.15,71.38 v47.15,74.63
SELBSTERHALTUNG  (via drill 0.3)
  Top 0.3: v69.22,65.33 v69.23,65.32 U$25.1 | v60.72,81.57 60.72,88.4 60.1,89.02 47.69,89.02 47.18,88.51 U1.8
  Top 0.5: R30.2 69.17,62.47 U$25.1
  Bottom 0.3: v69.22,65.33 69.22,73.07 v60.72,81.57
TEST
  Top 0.5: U$8.8 C9.1 72.83,68.64 U$24.3
TS
  Top 0.3: U2.8 23.41,33.35 27.27,29.5 27.27,26.74 28.59,25.41 U$2.8
  Top 2.184: U$3.PAD 29.53,23.83 U$2.8 28.59,23.45
  pour Top (no thermals): 27.8,11.8 48.2,11.8 48.2,9.4 52.6,9.4 52.6,16.9 33.2,16.9 33.2,22.3 27.8,22.3
UC_M_CONT  (via drill 0.3)
  Top 0.3: v35.7,48.09 35.14,48.65 35.14,84.29 35.48,84.62 40.62,84.62 42.94,82.31 45.84,82.31 U1.11 | U$21.1 v58.88,40.59
  Bottom 0.3: v58.88,40.59 43.2,40.59 35.72,48.07 v35.7,48.09
V_MEAS  (via drill 0.3)
  Top 0.3: U$14.1 86.06,97.24 86.9,96.4 86.9,93.04 | 86.9,84.64 86.9,80.44 | 86.9,88.84 86.9,84.64 | 86.9,93.04 86.9,88.84 | 86.9,80.44 86.9,77 86.5,76.6 86.25,76.6 U$9.1 | U$10.1 86.9,80.44 | 86.9,84.64 U$11.1 84.58,84.64 84.58,84.63 v84.15,84.63 | U$12.1 86.9,88.84 | U$13.1 86.9,93.04 | v43.35,83.15 U1.10
  Bottom 0.3: v84.15,84.63 55.8,84.63 54.3,83.13 43.5,83.13 43.48,83.15 v43.35,83.15
VIN_SENSE  (via drill 0.3)
  Top 0.3: v57.78,72.15 v57.78,72.14 R36.2 | v17.45,31.82 12.35,26.72 VIN.P$1 | C8.1 10.16,39.3 U$7.2@1
  Top 0.4: U$1.R U$1.L 9,25.56 VIN.P$1 10.16,39.19 U$7.2@1 U$7.2
  Bottom 0.3: v17.45,31.82 v57.78,72.15
  pour Top (no thermals): 4.5,30.3 16,30.3 16,22.7 9.6,22.7 9.6,17.4 4.5,17.4